# EAGLE design EDM switch (EAGLE 7.1.0)
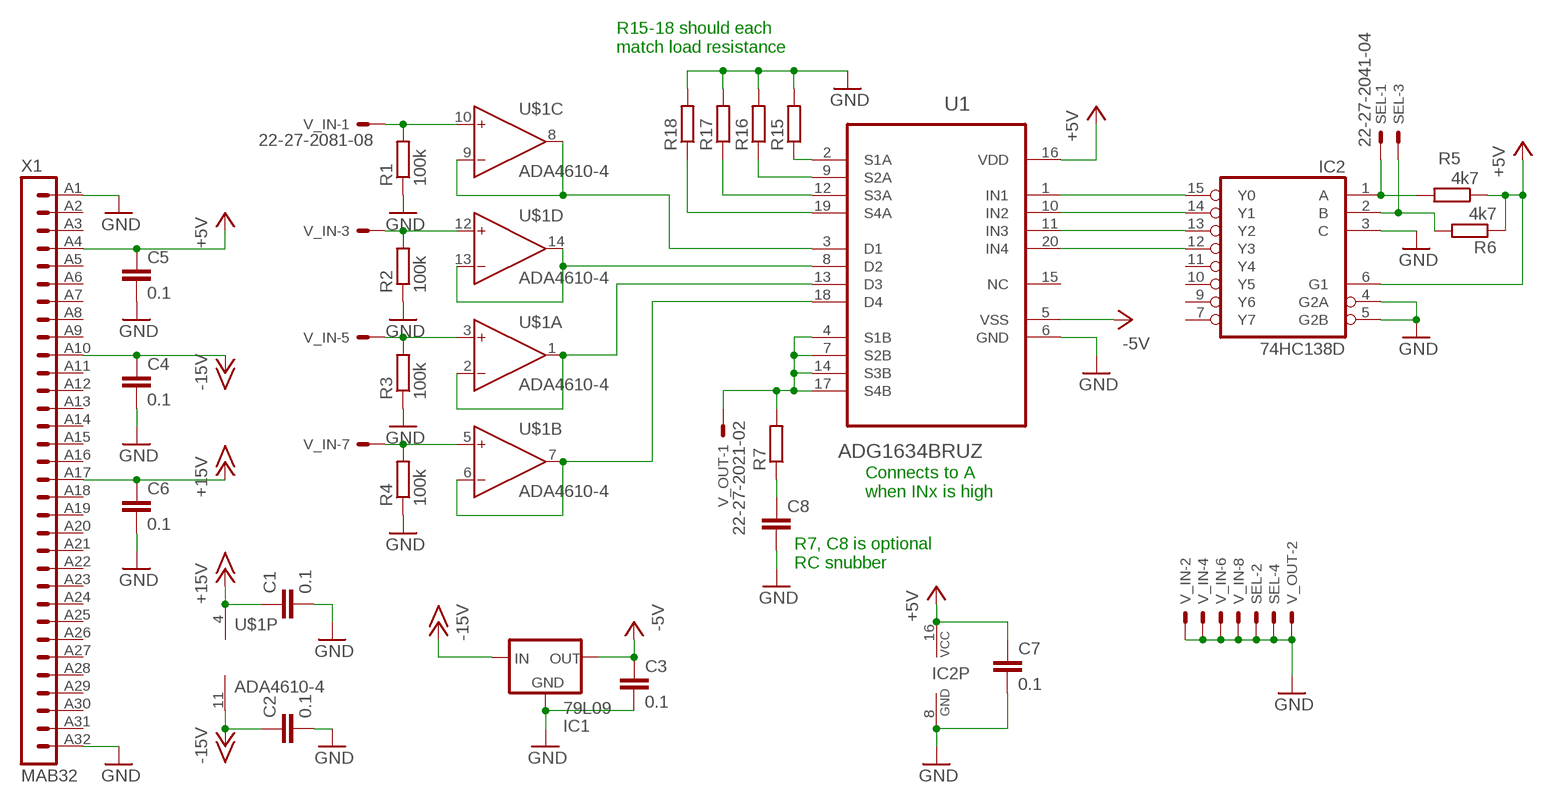
[diagram p0: schematic, sheet 1]

## Parts
C1  0.1  C-EUC0805  [C0805]
C2  0.1  C-EUC0805  [C0805]
C3  0.1  C-EUC0805  [C0805]
C4  0.1  C-EUC0805  [C0805]
C5  0.1  C-EUC0805  [C0805]
C6  0.1  C-EUC0805  [C0805]
C7  0.1  C-EUC0805  [C0805]
C8  C-EUC0805  [C0805]
IC1  79L09  79LXX  [79LXX]
IC2  74HC138D  [SO16]
R1  100k  R-EU_R0805  [R0805]
R2  100k  R-EU_R0805  [R0805]
R3  100k  R-EU_R0805  [R0805]
R4  100k  R-EU_R0805  [R0805]
R5  4k7  R-EU_R0805  [R0805]
R6  4k7  R-EU_R0805  [R0805]
R7  R-EU_R0805  [R0805]
R15  R-EU_0204/7  [0204/7]
R16  R-EU_0204/7  [0204/7]
R17  R-EU_0204/7  [0204/7]
R18  R-EU_0204/7  [0204/7]
SEL  22-27-2041-04  [6410-04]
U1  ADG1634BRUZ  [SOP65P640X120-20N]
U$1  ADA4610-4  [SO14]
V_IN  22-27-2081-08  [6410-08]
V_OUT  22-27-2021-02  [6410-02]
X1  MAB32  [MAB32]

## Nets
+5V: C5.1 C7.1 IC2.6(G1) IC2.16(VCC) R5.1 R6.1 U1.16(VDD) X1.A4
+15V: C1.1 C6.1 U$1.4(P:V+) X1.A17
-5V: C3.1 IC1.OUT U1.5(VSS)
-15V: C2.1 C4.1 IC1.IN U$1.11(P:V-) X1.A10
GND: C1.2 C2.2 C3.2 C4.2 C5.2 C6.2 C7.2 C8.2 IC1.GND IC2.3(C) IC2.4(G2A) IC2.5(G2B) IC2.8(GND) R1.1 R2.1 R3.1 R4.1 R15.2 R16.2 R17.2 R18.2 SEL.2 SEL.4 U1.6(GND) V_IN.2 V_IN.4 V_IN.6 V_IN.8 V_OUT.2 X1.A1 X1.A32
N$1: R1.2 U$1.10(C:IN+) V_IN.1
N$2: R2.2 U$1.12(D:IN+) V_IN.3
N$3: R3.2 U$1.3(A:IN+) V_IN.5
N$4: R4.2 U$1.5(B:IN+) V_IN.7
N$5: U1.3(D1) U$1.8(C:OUT) U$1.9(C:IN-)
N$6: U1.8(D2) U$1.13(D:IN-) U$1.14(D:OUT)
N$7: U1.13(D3) U$1.1(A:OUT) U$1.2(A:IN-)
N$8: U1.18(D4) U$1.6(B:IN-) U$1.7(B:OUT)
N$9: R15.1 U1.2(S1A)
N$10: R16.1 U1.9(S2A)
N$11: R17.1 U1.12(S3A)
N$12: R18.1 U1.19(S4A)
N$13: IC2.1(A) R5.2 SEL.1
N$14: R7.2 U1.4(S1B) U1.7(S2B) U1.14(S3B) U1.17(S4B) V_OUT.1
N$15: IC2.2(B) R6.2 SEL.3
N$16: IC2.15(Y0) U1.1(IN1)
N$17: IC2.14(Y1) U1.10(IN2)
N$18: IC2.13(Y2) U1.11(IN3)
N$19: IC2.12(Y3) U1.20(IN4)
N$21: C8.1 R7.1
Unconnected: IC2.7(Y7) IC2.9(Y6) IC2.10(Y5) IC2.11(Y4) U1.15(NC) X1.A2 X1.A3 X1.A5 X1.A6 X1.A7 X1.A8 X1.A9 X1.A11 X1.A12 X1.A13 X1.A14 X1.A15 X1.A16 X1.A18 X1.A19 X1.A20 X1.A21 X1.A22 X1.A23 X1.A24 X1.A25 X1.A26 X1.A27 X1.A28 X1.A29 X1.A30 X1.A31

## Notes on the sheet
- R15-18 should each
  match load resistance
- Connects to A
  when INx is high
- R7, C8 is optional
  RC snubber

## Library data of the parts
C1-C8 = rcl:C-EU: CAPACITOR, European symbol
IC1 = v-reg:79LXX: VOLTAGE REGULATOR
IC2 = 74xx-eu:74*138: 3-line to 8-line DECODER/DEMULTIPLEXER
R1-R7 R15-R18 = rcl:R-EU_: RESISTOR, European symbol
SEL = con-molex:22-?-04: CONNECTOR wire to board 2.54 mm (.1 inch) pitch header; OC_FARNELL: unknown; OC_NEWARK: unknown
U1 = custom_parts:ADG1634BRUZ: 4.5 Ù RON, Triple/Quad SPDT ±5 V, +12 V, +5 V, and +3.3 V Switches; MPN: ADG1634BRUZ; OC_FARNELL: 1858058; OC_NEWARK: 26R2422; PACKAGE: TSSOP-20; SUPPLIER: Analog Devices
U$1 = custom_parts:ADA4610-4: Low Noise, Precision, Rail-to-Rail Output, JFET Quad Op Amps 9.3MHz unity gain crossover
V_IN = con-molex:22-?-08: CONNECTOR wire to board 2.54 mm (.1 inch) pitch header; OC_FARNELL: unknown; OC_NEWARK: unknown
V_OUT = con-molex:22-?-02: CONNECTOR wire to board 2.54 mm (.1 inch) pitch header; OC_FARNELL: unknown; OC_NEWARK: unknown
X1 = con-vg:MAB32: CONNECTOR male, 32 pins, type B, row A, grid 2.54 mm

## Board
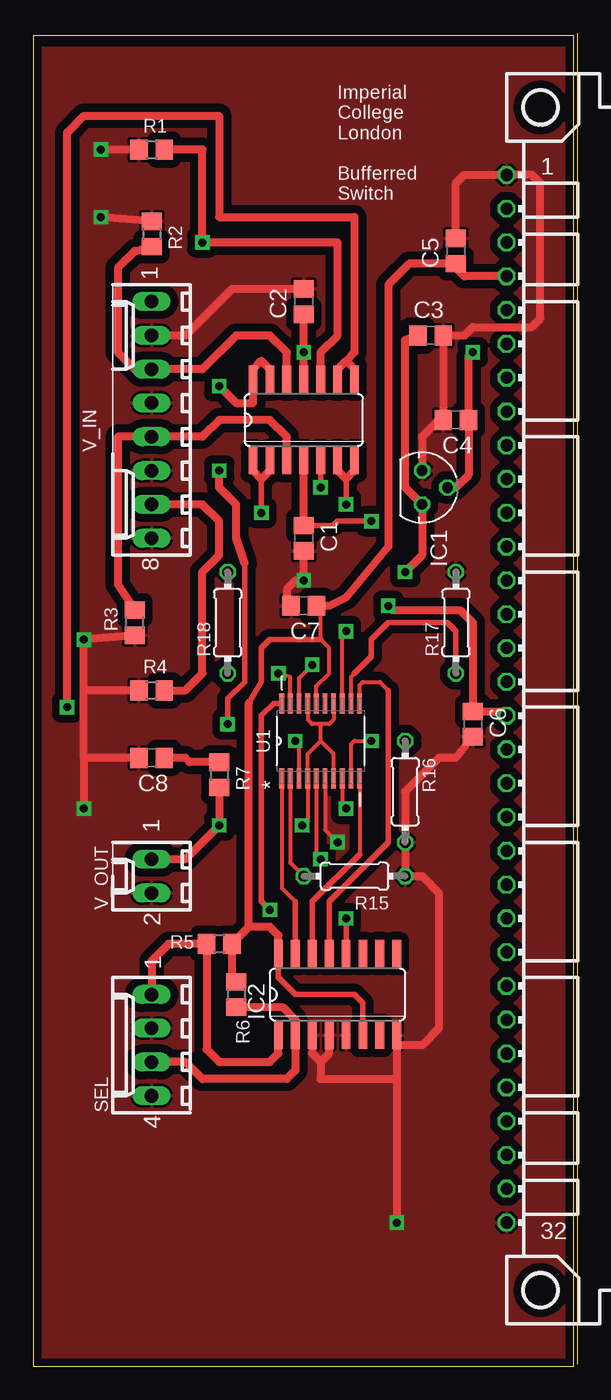
[diagram p1: board, top side]
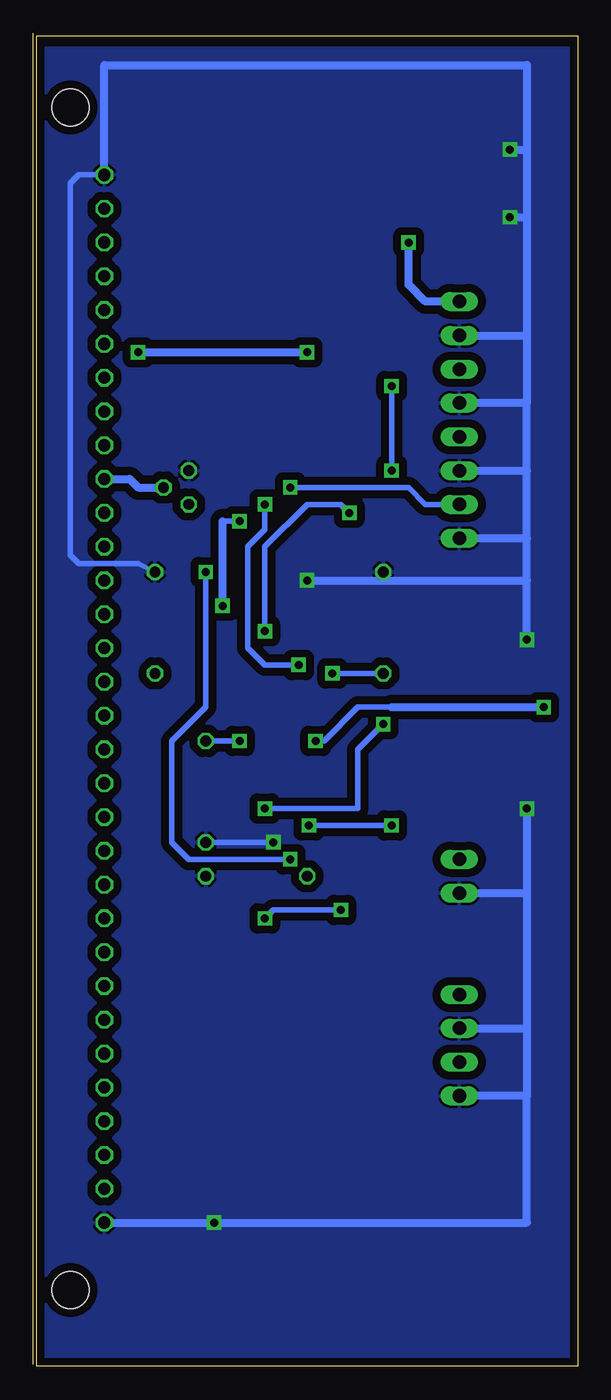
[diagram p2: board, bottom side, seen from below]

Size 40.62 x 100 mm. Coordinates in mm from the lower left corner, seen from the top.
Outline: 0,0 40.62,0 40.62,100 0,100 0,0
Copper layers (1*16): Top 0.035mm / dielectric 1.5mm / Bottom 0.035mm
Design rules "PCB-POOL Standard": minimum track width 0.15mm, minimum drill 0.3mm, track to track 0.15mm, track to pad 0.15mm, pad to pad 0.15mm, via to via 0.15mm, smd to smd 0.15mm, copper to edge 0.3mm, drill to drill 0.2mm, minimum pad ring 0.2mm, minimum via ring 0.15mm, stop-mask expansion 0.075mm, vias tented up to drill 0mil, thermal gap 0.2mm

### Footprints (pad centres in the part's own frame; a part is rotated, then mirrored left to right if it is on the bottom)
C0805 = smd 1.3 x 1.5: 1 -0.95,0; 2 0.95,0
79LXX = drill 0.813 octagon: GND -1.27,0; IN 0,1.905; OUT 1.27,0
SO16 = smd 0.66 x 2.032: 1 -4.445,-3.073; 2 -3.175,-3.073; 3 -1.905,-3.073; 4 -0.635,-3.073; 5 0.635,-3.073; 6 1.905,-3.073; 7 3.175,-3.073; 8 4.445,-3.073; 9 4.445,3.073; 10 3.175,3.073; 11 1.905,3.073; 12 0.635,3.073; 13 -0.635,3.073; 14 -1.905,3.073; 15 -3.175,3.073; 16 -4.445,3.073
R0805 = smd 1.3 x 1.5: 1 -0.95,0; 2 0.95,0
0204/7 = drill 0.813 octagon: 1 -3.81,0; 2 3.81,0
6410-04 = drill 1.016 long: 1 3.81,0; 2 1.27,0; 3 -1.27,0; 4 -3.81,0
SOP65P640X120-20N = smd 1.473 x 0.356: 1 -2.819,2.921; 2 -2.819,2.286; 3 -2.819,1.626; 4 -2.819,0.965; 5 -2.819,0.33; 6 -2.819,-0.33; 7 -2.819,-0.965; 8 -2.819,-1.626; 9 -2.819,-2.286; 10 -2.819,-2.921; 11 2.819,-2.921; 12 2.819,-2.286; 13 2.819,-1.626; 14 2.819,-0.965; 15 2.819,-0.33; 16 2.819,0.33; 17 2.819,0.965; 18 2.819,1.626; 19 2.819,2.286; 20 2.819,2.921
SO14 = smd 0.66 x 2.032: 1 -3.81,-3.073; 2 -2.54,-3.073; 3 -1.27,-3.073; 4 0,-3.073; 5 1.27,-3.073; 6 2.54,-3.073; 7 3.81,-3.073; 8 3.81,3.073; 9 2.54,3.073; 10 1.27,3.073; 11 0,3.073; 12 -1.27,3.073; 13 -2.54,3.073; 14 -3.81,3.073
6410-08 = drill 1.016 long: 1 8.89,0; 2 6.35,0; 3 3.81,0; 4 1.27,0; 5 -1.27,0; 6 -3.81,0; 7 -6.35,0; 8 -8.89,0
6410-02 = drill 1.016 long: 1 1.27,0; 2 -1.27,0
MAB32 = drill 0.914 octagon: A1 -2.54,39.37; A2 -2.54,36.83; A3 -2.54,34.29; A4 -2.54,31.75; A5 -2.54,29.21; A6 -2.54,26.67; A7 -2.54,24.13; A8 -2.54,21.59; A9 -2.54,19.05; A10 -2.54,16.51; A11 -2.54,13.97; A12 -2.54,11.43; A13 -2.54,8.89; A14 -2.54,6.35; A15 -2.54,3.81; A16 -2.54,1.27; A17 -2.54,-1.27; A18 -2.54,-3.81; A19 -2.54,-6.35; A20 -2.54,-8.89; A21 -2.54,-11.43; A22 -2.54,-13.97; A23 -2.54,-16.51; A24 -2.54,-19.05; A25 -2.54,-21.59; A26 -2.54,-24.13; A27 -2.54,-26.67; A28 -2.54,-29.21; A29 -2.54,-31.75; A30 -2.54,-34.29; A31 -2.54,-36.83; A32 -2.54,-39.37 | hole 2.794: 0,44.45; 0,-44.45

### Placement (x,y rotation side)
C1  20.32,62.23 270 top
C2  20.32,80.01 90 top
C3  29.84,77.47 0 top
C4  31.75,71.12 180 top
C5  31.75,83.82 90 top
C6  33.02,48.26 270 top
C7  20.32,57.15 180 top
C8  8.89,45.72 180 top
IC1  29.21,66.04 270 top
IC2  22.86,27.94 0 top
R1  8.89,91.44 0 top
R2  8.89,85.09 270 top
R3  7.62,55.88 90 top
R4  8.89,50.8 0 top
R5  13.97,31.75 180 top
R6  15.24,27.94 270 top
R7  13.97,44.45 270 top
R15  24.13,36.83 0 top
R16  27.94,43.18 270 top
R17  31.75,55.88 90 top
R18  14.61,55.88 90 top
SEL  8.89,24.13 90 top
U1  21.59,46.99 90 top
U$1  20.32,71.12 0 top
V_IN  8.89,71.12 90 top
V_OUT  8.89,36.83 90 top
X1  38.1,50.16 0 top

### Tracks (layer width: path | path; a pad name or v marks a point on that pad's centre or on a via)
+5V
  Top 0.305: U1.16 21.26,51.1 22.22,52.07 22.22,53.98 21.59,54.61 21.59,56.83 C7.1
  Top 0.406: IC2.6 24.77,27.3 24.13,27.94 19.69,27.94 18.41,29.21 IC2.16 | 16.19,49.84 17.15,51.44 17.15,53.98 17.78,54.61 21.59,54.61
  Top 0.61: IC2.16 18.41,32.38 17.78,33.02 16.19,33.02 | 16.19,33.02 R5.1 14.92,29.21 R6.1 | X1.A4 32.38,81.92 31.75,82.55 C5.1 28.26,82.87 26.67,81.28 26.67,61.59 23.5,57.78 22.22,57.15 C7.1 | 16.19,33.02 16.19,49.84
+15V  (via drill 0.6)
  Top 0.406: C1.1 22.54,63.18 22.86,63.5 v25.4,63.5
  Top 0.61: C1.1 U$1.4 | X1.A17 35.25,49.21 C6.1 33.02,55.88 32.07,56.83 26.99,56.83 v26.67,57.15
  Bottom 0.406: v25.4,63.5 26.67,63.5
  Bottom 0.61: v26.67,57.15 26.67,63.5
-5V  (via drill 0.6)
  Top 0.305: U1.5 21.26,38.43
  Top 0.406: 21.26,38.43 v21.59,38.1
  Top 0.61: C3.1 27.94,77.15 27.94,66.04 IC1.OUT 29.21,60.96 v27.94,59.69
  Bottom 0.406: v21.59,38.1 29.21,38.1 30.48,39.37 30.48,46.99 27.94,49.53 v27.94,59.69
-15V  (via drill 0.6)
  Top 0.61: IC1.IN 31.75,66.04 32.7,66.99 C4.1 32.7,75.88 v33.02,76.2 | C2.1 v20.32,76.2 U$1.11
  Bottom 0.61: X1.A10 33.66,66.67 33.02,66.04 IC1.IN | v33.02,76.2 v20.32,76.2
GND  (via drill 0.6)
  Top 0.305: U1.6 21.92,40.31 v22.86,39.37
  Top 0.61: R3.1 v3.81,54.61 3.81,50.8 | R4.1 3.81,50.8 | C8.2 3.81,45.72 | 3.81,45.72 3.81,50.8 | 3.81,45.72 v3.81,41.91 | R1.1 v5.08,91.44 | R2.1 v5.08,86.36 | C1.2 v20.32,59.05 19.69,59.05 19.05,58.42 19.05,57.47 C7.2 | IC2.8 27.31,24.13 | 27.31,24.13 27.31,21.59 | 27.31,21.59 v27.31,10.79 | IC2.3 20.96,23.5 21.59,22.86 | 21.59,22.86 22.22,23.5 IC2.4 | 31.43,85.09 C5.2 31.75,88.9 32.38,89.53 X1.A1 37.47,89.53 38.1,88.9 38.1,78.74 37.47,78.11 33.02,78.11 32.38,77.47 C3.2 C4.2 30.48,71.12 29.21,69.85 IC1.GND | C6.2 31.75,45.72 30.48,45.72 27.94,43.18 R16.2 R15.2 29.21,36.83 30.48,35.56 30.48,25.4 29.21,24.13 27.31,24.13 | 21.59,22.86 21.59,21.59 27.31,21.59 | C2.2 14.92,80.96 11.43,77.47 V_IN.2
  Bottom 0.406: v22.86,39.37 R16.2 | R18.2 14.61,59.05 | R17.2 33.02,60.33 37.47,60.33 38.1,60.96 38.1,88.9 37.47,89.53 X1.A1
  Bottom 0.61: V_IN.2 3.81,77.47 | 3.81,77.47 3.81,72.39 | 3.81,72.39 V_IN.4 | V_IN.6 3.81,67.31 | 3.81,67.31 3.81,72.39 | V_IN.8 3.81,62.23 | 3.81,62.23 3.81,67.31 | SEL.2 3.81,25.4 | 3.81,25.4 3.81,20.32 | 3.81,20.32 SEL.4 | V_OUT.2 3.81,35.56 | 3.81,35.56 3.81,25.4 | v3.81,41.91 3.81,35.56 | v3.81,54.61 3.81,59.05 | 3.81,59.05 3.81,62.23 | X1.A1 35.56,97.79 3.81,97.79 3.81,91.44 | 3.81,91.44 3.81,86.36 | 3.81,86.36 3.81,77.47 | v5.08,91.44 3.81,91.44 | v5.08,86.36 3.81,86.36 | v20.32,59.05 14.61,59.05 3.81,59.05 | X1.A32 v27.31,10.79 3.81,10.79 3.81,20.32
  pour Top (isolate 0.61): 0,0 0,99.06 40.64,99.06 40.64,1.27 40.64,0
  pour Bottom (isolate 0.61): 0,0 0,99.06 40.64,99.06 40.64,0
N$1  (via drill 0.6)
  Top 0.61: R1.2 12.7,91.44 v12.7,84.45 22.86,84.45 22.86,77.47 21.59,76.2 U$1.10
  Bottom 0.61: V_IN.1 11.43,80.01 12.7,81.28 v12.7,84.45
N$2
  Top 0.61: U$1.12 19.05,76.2 17.78,77.47 15.24,77.47 12.7,74.93 V_IN.3 7.62,74.93 6.35,76.2 6.35,82.55 7.62,83.82 R2.2
N$3
  Top 0.61: U$1.3 19.05,69.85 17.78,71.12 13.97,71.12 12.7,69.85 V_IN.5 6.35,69.85 6.35,59.69 6.35,58.74 R3.2
N$4  (via drill 0.6)
  Top 0.406: U$1.5 v21.59,66.04
  Top 0.61: R4.2 11.43,50.8 12.7,52.07 12.7,59.69 13.97,60.96 13.97,63.5 12.7,64.77 V_IN.7
  Bottom 0.406: v21.59,66.04 12.7,66.04 11.43,64.77 V_IN.7
N$5  (via drill 0.6)
  Top 0.305: U1.3 19.96,46.71
  Top 0.406: 19.96,46.71 v19.69,46.99
  Top 0.61: U$1.9 22.86,74.93 23.5,75.56 | 23.5,75.56 24.13,74.93 U$1.8 | v2.54,49.53 2.54,92.71 3.81,93.98 13.97,93.98 13.97,86.36 24.13,86.36 24.13,76.2 23.5,75.56
  Bottom 0.406: v19.69,46.99 19.05,46.99 16.51,49.53 13.97,49.53
  Bottom 0.61: 13.97,49.53 v2.54,49.53
N$6  (via drill 0.6)
  Top 0.305: U1.8 23.22,42.19
  Top 0.406: 23.22,42.19 v23.5,41.91 | v14.61,48.26 14.61,50.16 15.88,51.44 15.88,60.33
  Top 0.61: U$1.13 17.78,74.93 17.15,75.56 16.51,74.93 U$1.14 16.51,72.39 15.24,72.39 v13.97,73.66 | 15.88,60.33 15.24,62.23 15.24,64.77 13.97,66.04 v13.97,67.31
  Bottom 0.406: v23.5,41.91 16.51,41.91 16.51,46.35 v14.61,48.26 | v13.97,67.31 v13.97,73.66
N$7  (via drill 0.6)
  Top 0.305: U1.13 23.22,54.97
  Top 0.406: 23.22,54.97 v23.5,55.24 | v17.15,64.14 17.15,66.67
  Top 0.61: U$1.2 17.78,67.31 17.15,66.67 16.51,67.31 U$1.1
  Bottom 0.406: v23.5,55.24 23.5,61.59 20.32,64.77 17.78,64.77 v17.15,64.14
N$8  (via drill 0.6)
  Top 0.305: U1.18 19.96,51.71 v20.96,52.7
  Top 0.406: v23.5,64.77 23.5,66.67
  Top 0.61: U$1.6 22.86,67.31 23.5,66.67 24.13,67.31 U$1.7
  Bottom 0.406: v20.96,52.7 23.5,52.7 24.77,53.98 24.77,61.59 23.5,62.87 v23.5,64.77
N$9
  Top 0.305: U1.2 19.3,37.85 R15.1
N$10  (via drill 0.6)
  Top 0.305: U1.9 23.88,46.74 24.13,46.99 v25.4,46.99
  Bottom 0.406: v25.4,46.99 R16.1
N$11
  Top 0.305: U1.12 23.88,51.82 24.13,52.07
  Top 0.406: 24.13,52.07 25.4,53.34 25.4,54.61 26.67,55.88 31.12,55.88 31.75,55.24 R17.1
N$12  (via drill 0.6)
  Top 0.305: U1.19 19.3,51.82 v18.41,52.07
  Bottom 0.406: v18.41,52.07 R18.1
N$13
  Top 0.61: SEL.1 8.89,30.48 10.16,31.75 R5.2 13.02,23.81 13.97,22.86 17.78,22.86 18.41,23.5 IC2.1
N$14  (via drill 0.6)
  Top 0.305: U1.14 22.56,48.59 22.22,48.26 21.59,48.26 | 21.59,48.26 20.96,48.26 20.62,48.59 U1.17 | 21.59,46.99 20.62,46.02 U1.4 20.62,40.95 v20.19,40.64 | 21.59,46.99 21.59,48.26 | U1.7 22.56,46.02 21.59,46.99
  Top 0.61: R7.2 v13.97,40.64 11.43,38.1 V_OUT.1
  Bottom 0.406: v20.19,40.64 v13.97,40.64
N$15
  Top 0.61: SEL.3 11.43,22.86 12.7,21.59 19.05,21.59 19.69,22.23 IC2.2 19.69,26.04 18.73,26.99 R6.2
N$16
  Top 0.305: U1.1 18.67,35.94 19.69,34.92
  Top 0.406: 19.69,34.92 IC2.15
N$17
  Top 0.305: U1.10 24.51,38.48
  Top 0.406: 24.51,38.48 20.96,34.92 IC2.14
N$18
  Top 0.305: U1.11 24.51,51.18 24.77,51.44 26.03,51.44 26.67,50.8
  Top 0.406: 26.67,50.8 26.67,39.37 22.22,34.92 IC2.13
N$19  (via drill 0.6)
  Top 0.406: U1.20 18.06,49.81 17.15,48.9 17.15,34.92 v17.78,34.29 | v23.5,33.66 IC2.12
  Bottom 0.406: v17.78,34.29 22.86,34.29 v23.5,33.66
N$21
  Top 0.61: R7.1 11.75,45.4 11.43,45.72 C8.1

### Text on the board
tNames: Imperial / College / London / / Bufferred / Switch